# Altium schematic sheet PW5410B_2024-04-30.schdoc
size 52 x 32 mm
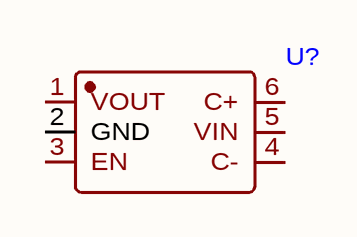
[diagram p0: PW5410B_2024-04-30.schdoc]

## Parts
U?  (no value)  [SOT-23-6_L2.9-W1.6-P0.95-LS2.8-BL-1]

## Nets

Not connected (* = marked no-connect by the designer): U? 1(VOUT) 2(GND) 3(EN) 4(C-) 5(VIN) 6(C+)

## Library data of the parts
U? = PW5410B